# EAGLE design Motorsteuerung (EAGLE 6.0)
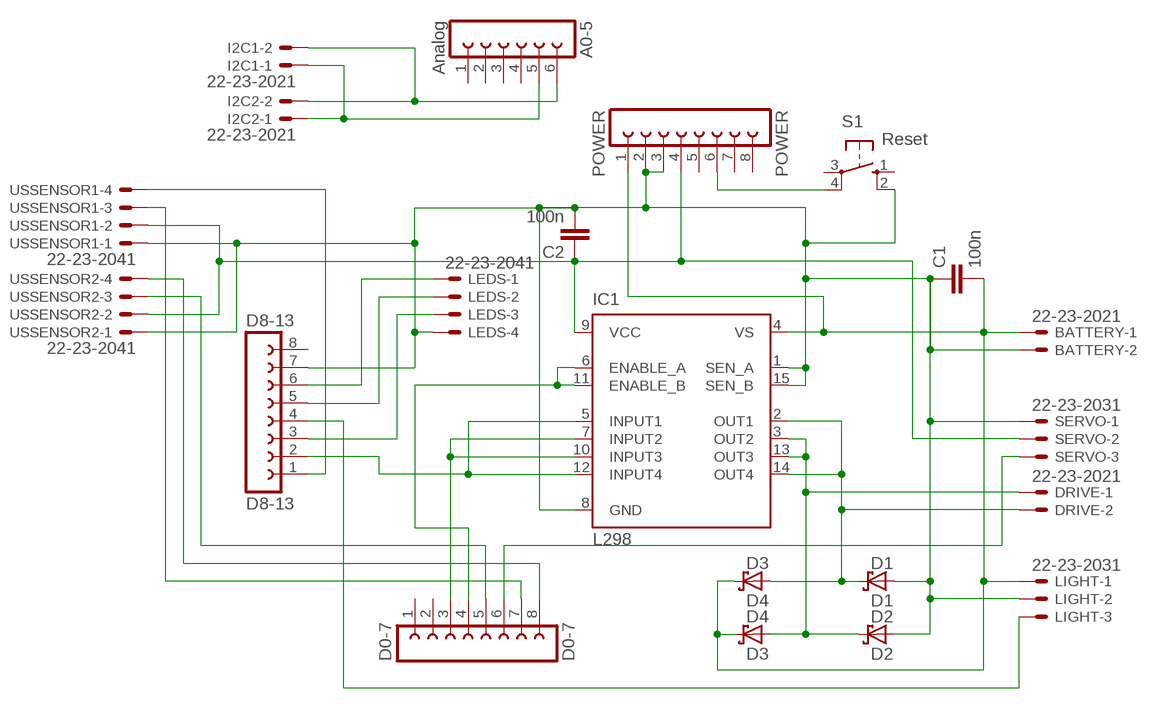
[diagram p0: schematic, sheet 1]

## Parts
A0-5  Analog  FE06-1  [FE06]
BATTERY  22-23-2021  [22-23-2021]
C1  100n  C-EU025-030X050  [C025-030X050]
C2  100n  C-EU025-030X050  [C025-030X050]
D0-7  D0-7  FE08-1  [FE08]
D1  D1  SCHOTTKY-DIODEDO201T15  [DO201T15]
D2  D2  SCHOTTKY-DIODEDO201T15  [DO201T15]
D3  D4  SCHOTTKY-DIODEDO201T15  [DO201T15]
D4  D3  SCHOTTKY-DIODEDO201T15  [DO201T15]
D8-13  D8-13  FE08-1  [FE08]
DRIVE  22-23-2021  [22-23-2021]
I2C1  22-23-2021  [22-23-2021]
I2C2  22-23-2021  [22-23-2021]
IC1  L298  [MULTIWATT-15]
LEDS  22-23-2041  [22-23-2041]
LIGHT  22-23-2031  [22-23-2031]
POWER  POWER  FE08-1  [FE08]
S1  Reset  10-XX  [B3F-10XX]
SERVO  22-23-2031  [22-23-2031]
USSENSOR1  22-23-2041  [22-23-2041]
USSENSOR2  22-23-2041  [22-23-2041]

## Nets
GND: BATTERY.2 C1.1 C2.2 D1.A D2.A D8-13.7 IC1.1(SEN_A) IC1.8(GND) IC1.15(SEN_B) LEDS.4 LIGHT.2 POWER.2 POWER.3 S1.2(S1) SERVO.1 USSENSOR1.1 USSENSOR2.1
N$1: D1.C D4.A DRIVE.2 IC1.2(OUT1) IC1.14(OUT4)
N$3: D0-7.6 SERVO.3
N$4: D0-7.8 USSENSOR2.4
N$5: D2.C D3.A DRIVE.1 IC1.3(OUT2) IC1.13(OUT3)
N$6: D8-13.5 LEDS.2
N$8: D8-13.2 IC1.5(INPUT1) IC1.12(INPUT4)
N$9: D0-7.5 USSENSOR2.3
N$10: D0-7.3 IC1.7(INPUT2) IC1.10(INPUT3)
N$11: D0-7.4 IC1.6(ENABLE_A) IC1.11(ENABLE_B)
N$12: D8-13.1 USSENSOR1.4
N$13: D8-13.3 LEDS.3
N$14: D8-13.4 LIGHT.3
N$16: D8-13.6 LEDS.1
N$17: D0-7.7 USSENSOR1.3
N$19: A0-5.5 I2C1.1 I2C2.1
N$20: POWER.6 S1.4(P1)
N$21: A0-5.6 I2C1.2 I2C2.2
VCC: C2.1 IC1.9(VCC) POWER.4 SERVO.2 USSENSOR1.2 USSENSOR2.2
VS: BATTERY.1 C1.2 D3.C D4.C IC1.4(VS) LIGHT.1 POWER.1
Unconnected: A0-5.1 A0-5.2 A0-5.3 A0-5.4 D0-7.1 D0-7.2 D8-13.8 POWER.5 POWER.7 POWER.8 S1.1(S) S1.3(P)

## Library data of the parts
A0-5 = con-lsta:FE06-1: FEMALE HEADER; OC_FARNELL: unknown; OC_NEWARK: unknown
BATTERY DRIVE I2C1 I2C2 = con-molex:22-23-2021: .100" (2.54mm) Center Header - 2 Pin; MF: MOLEX; MPN: 22-23-2021; OC_FARNELL: 1462926; OC_NEWARK: 25C3832
C1 C2 = rcl:C-EU: CAPACITOR, European symbol
D0-7 D8-13 POWER = con-lsta:FE08-1: FEMALE HEADER; OC_FARNELL: unknown; OC_NEWARK: unknown
D1-D4 = diode:SCHOTTKY-DIODE: Schottky Diode
IC1 = st-microelectronics:L298: DUAL FULL-BRIDGE DRIVER; MPN: L298N; OC_FARNELL: 1589425; OC_NEWARK: 32M1527
LEDS USSENSOR1 USSENSOR2 = con-molex:22-23-2041: .100" (2.54mm) Center Header - 4 Pin; MF: MOLEX; MPN: 22-23-2041; OC_FARNELL: 1462920; OC_NEWARK: 38C0355
LIGHT SERVO = con-molex:22-23-2031: .100" (2.54mm) Center Header - 3 Pin; MF: MOLEX; MPN: 22-23-2031; OC_FARNELL: 1462950; OC_NEWARK: 30C0862
S1 = switch-omron:10-XX: OMRON SWITCH; MPN: B3F-1000; OC_FARNELL: 176432; OC_NEWARK: 36M3542

## Board
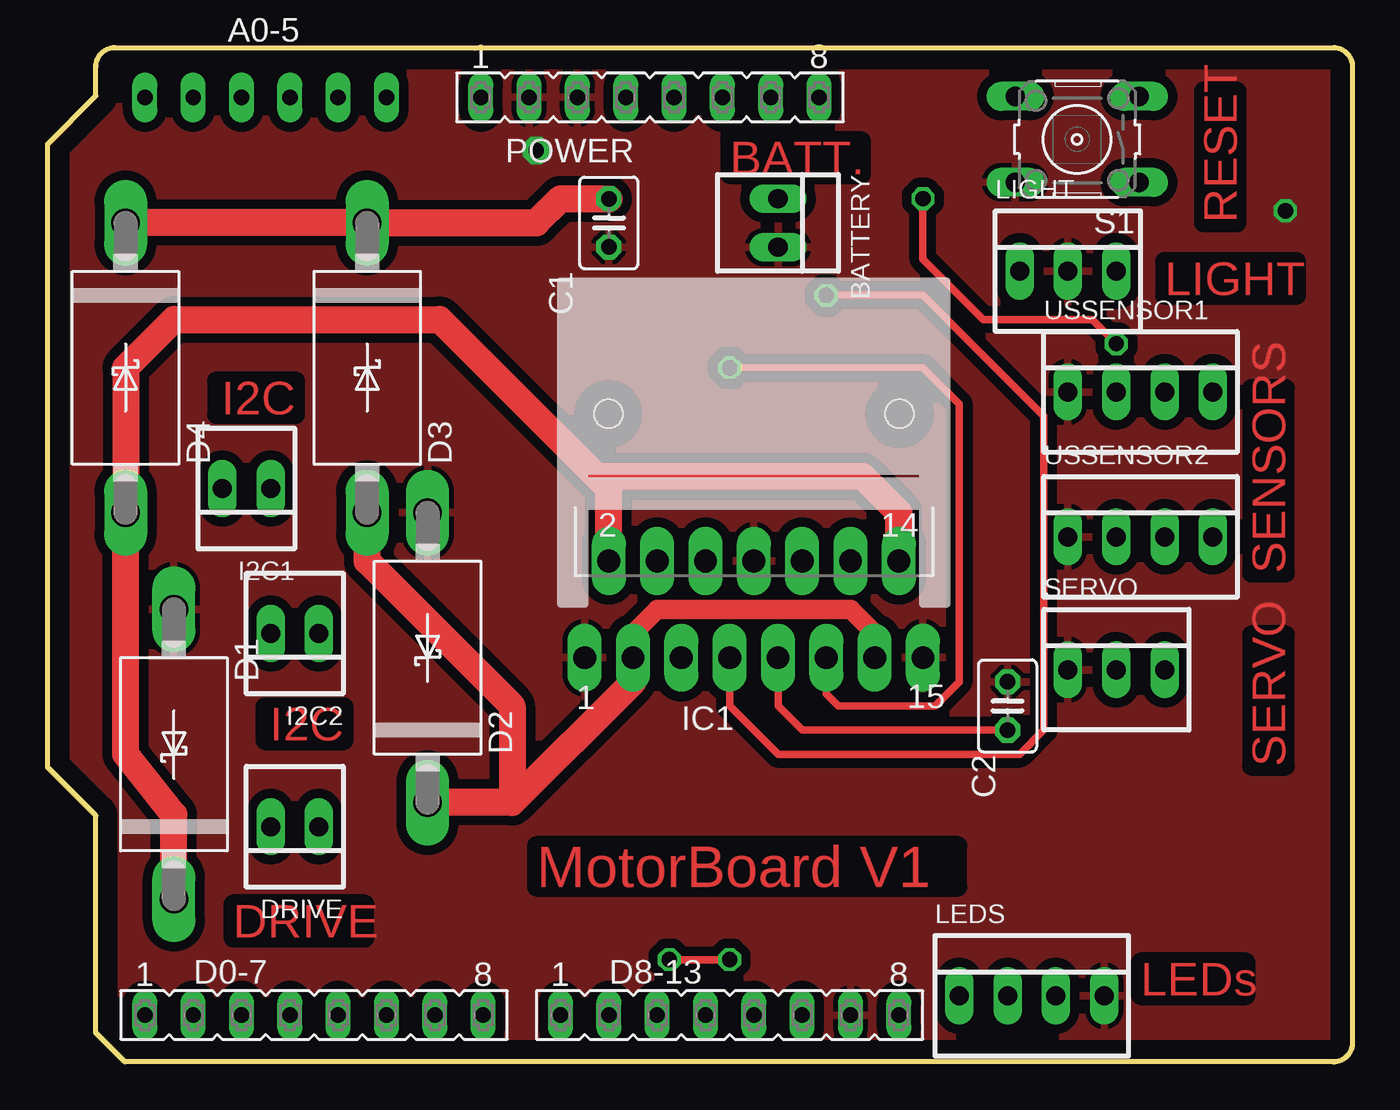
[diagram p1: board, top side]
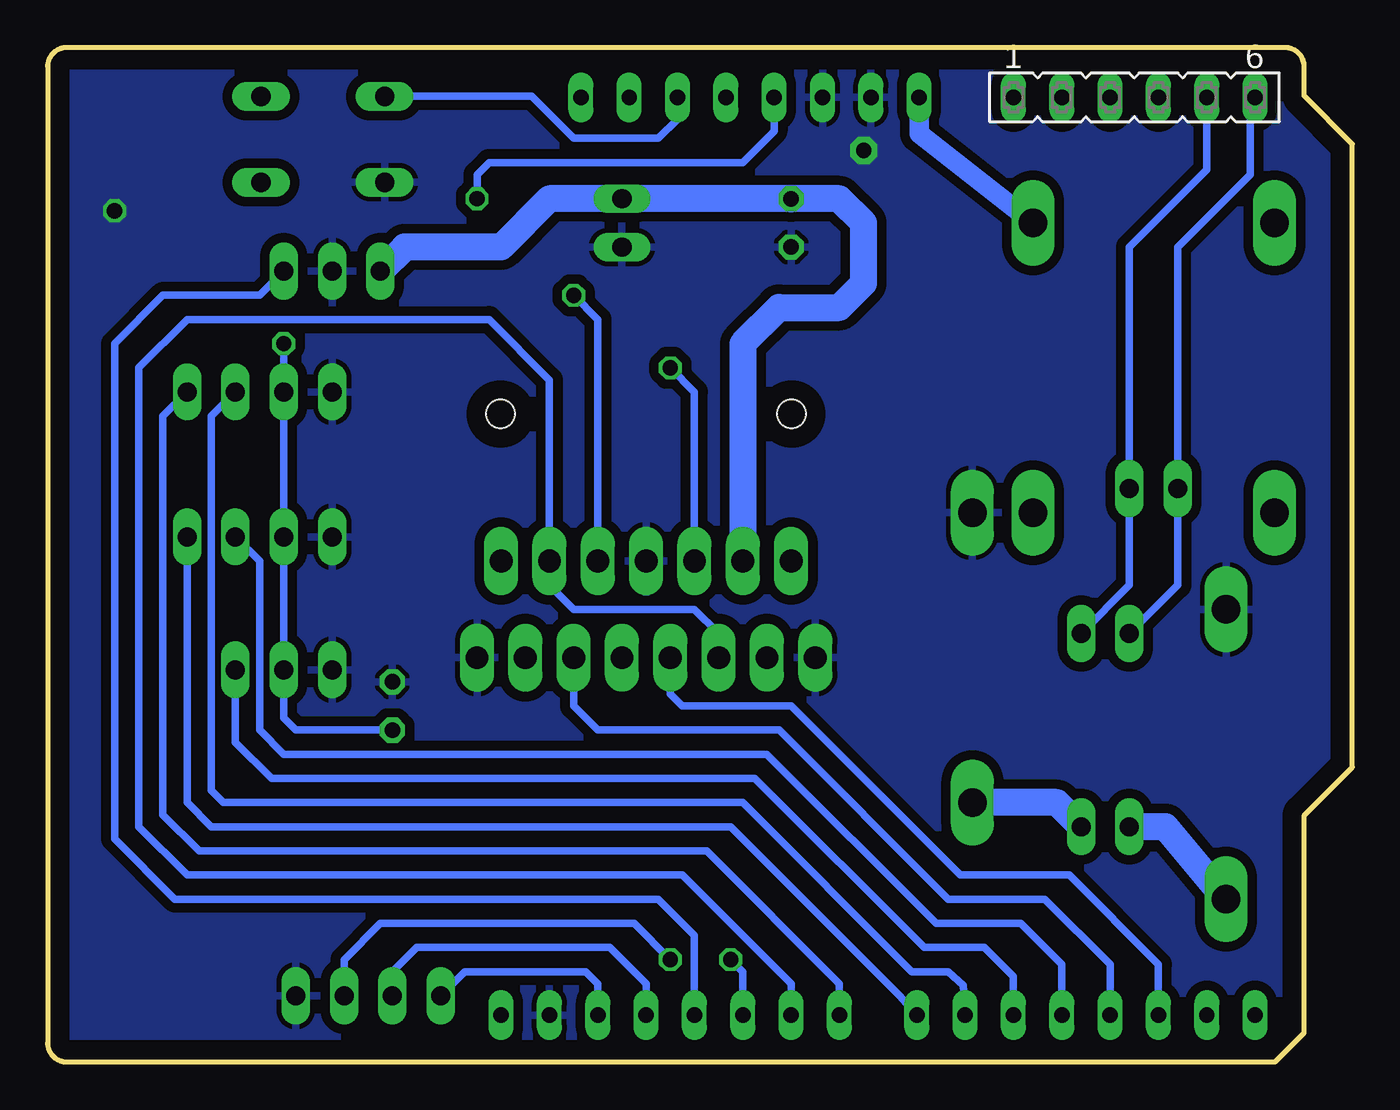
[diagram p2: board, bottom side, seen from below]

Size 68.58 x 53.34 mm. Coordinates in mm from the lower left corner, seen from the top.
Outline: 4.06,0 2.54,1.52 2.54,12.95 0,15.49 0,48.26 2.54,50.8 2.54,52.34 arc-90 3.54,53.34 67.58,53.34 arc-90 68.58,52.34 68.58,1 arc-90 67.58,0 4.06,0
Copper layers (1*16): Top 0.035mm / dielectric 1.5mm / Bottom 0.035mm
Design rules: minimum track width 10mil, minimum drill 24mil, track to track 8mil, track to pad 8mil, pad to pad 8mil, via to via 8mil, smd to smd 8mil, copper to edge 40mil, drill to drill 8mil, minimum pad ring 10mil, minimum via ring 8mil, stop-mask expansion 4mil, vias tented up to drill 0mil, thermal gap 10mil
Holes 1.5 mm at 29.47,34.07 44.77,34.07

### Footprints (pad centres in the part's own frame; a part is rotated, then mirrored left to right if it is on the bottom)
FE06 = drill 0.813 long: 1 -6.35,0; 2 -3.81,0; 3 -1.27,0; 4 1.27,0; 5 3.81,0; 6 6.35,0
22-23-2021 = drill 1 long: 1 -1.27,0; 2 1.27,0
C025-030X050 = drill 0.813 octagon: 1 -1.27,0; 2 1.27,0
FE08 = drill 0.813 long: 1 -8.89,0; 2 -6.35,0; 3 -3.81,0; 4 -1.27,0; 5 1.27,0; 6 3.81,0; 7 6.35,0; 8 8.89,0
DO201T15 = drill 1.499 long: A 7.62,0; C -7.62,0
MULTIWATT-15 = drill 1.2 long: 1 -8.89,-7.62; 2 -7.62,-2.54; 3 -6.35,-7.62; 4 -5.08,-2.54; 5 -3.81,-7.62; 6 -2.54,-2.54; 7 -1.27,-7.62; 8 0,-2.54; 9 1.27,-7.62; 10 2.54,-2.54; 11 3.81,-7.62; 12 5.08,-2.54; 13 6.35,-7.62; 14 7.62,-2.54; 15 8.89,-7.62
22-23-2041 = drill 1 long: 1 -3.81,0; 2 -1.27,0; 3 1.27,0; 4 3.81,0
22-23-2031 = drill 1 long: 1 -2.54,0; 2 0,0; 3 2.54,0
B3F-10XX = drill 1.016 long: 1 -3.251,2.261; 2 3.251,2.261; 3 -3.251,-2.261; 4 3.251,-2.261

### Placement (x,y rotation side)
A0-5  11.47,50.72 0 bottom
BATTERY  38.39,44.12 270 top
C1  29.5,44.12 90 top
C2  50.46,18.72 90 top
D0-7  14.01,2.46 0 top
D1  6.64,16.18 90 top
D2  19.97,21.26 90 top
D3  16.8,36.5 270 top
D4  4.1,36.5 270 top
D8-13  35.85,2.46 0 top
DRIVE  12.99,12.37 180 top
I2C1  10.45,30.15 180 top
I2C2  12.99,22.53 180 top
IC1  37.12,28.88 0 top
LEDS  51.73,3.48 0 top
LIGHT  53.63,41.58 0 top
POWER  31.66,50.72 0 top
S1  54.11,48.51 180 top
SERVO  56.17,20.62 0 top
USSENSOR1  57.44,35.23 0 top
USSENSOR2  57.44,27.61 0 top

### Tracks (layer width: path | path; a pad name or v marks a point on that pad's centre or on a via)
GND  (via drill 0.8, 0.8 pad 1.42)
  other vias: 65.06,44.76 25.69,47.93
  pour Top (isolate 0.5): 69.02,54.67 2.02,53.67 -0.98,48.67 -0.98,14.67 2.02,12.67 2.02,0.67 3.02,-0.33 69.02,-0.33
  pour Bottom (isolate 0.5): 1.56,54.28 1.56,51.74 -0.98,49.2 -0.98,14.91 1.56,12.37 1.56,0.94 2.83,-0.33 68.87,-0.33 68.87,54.28
N$1
  Top 1.422: 28.86,30.79 42.84,30.79 44.74,28.88 IC1.14 | D1.C 6.64,13.01 4.1,16.18 D4.A 4.1,36.5 6.64,39.04 20.61,39.04 28.86,30.79 | IC1.2 29.5,30.15 28.86,30.79
  Bottom 1.422: D1.C 9.81,12.37 DRIVE.2
N$3
  Bottom 0.406: D0-7.6 17.82,4.5 19.34,6.02 22.52,6.02 31.4,14.91 56.8,14.91 58.71,16.82 SERVO.3
N$4
  Bottom 0.406: USSENSOR2.4 61.25,13.64 59.98,12.37 32.68,12.37 23.79,3.48 D0-7.8
N$5
  Top 1.016: IC1.3 30.77,22.53 32.04,23.8 42.2,23.8 43.47,22.53 IC1.13
  Top 1.422: 24.42,13.64 30.77,19.99 IC1.3 | D3.A 16.8,26.34 24.42,18.72 24.42,13.64 | 24.42,13.64 D2.C
  Bottom 1.422: DRIVE.1 15.53,13.64 D2.C
N$6
  Bottom 0.406: D8-13.5 37.12,4.12 39.03,6.02 49.19,6.02 50.46,4.75 LEDS.2
N$8
  Bottom 0.406: IC1.5 33.31,22.53 34.58,23.8 40.93,23.8 42.2,25.07 IC1.12 42.2,35.87 45.38,39.04 61.25,39.04 63.79,36.5 63.79,12.37 61.25,9.83 35.22,9.83 29.5,4.12 D8-13.2
N$9
  Bottom 0.406: D0-7.5 15.28,5.13 17.43,7.29 21.88,7.29 30.77,16.18 56.17,16.18 57.44,17.45 57.44,26.34 USSENSOR2.3
N$10  (via drill 0.8)
  Top 0.406: IC1.7 35.85,18.72 38.39,16.18 51.09,16.18 52.36,17.45 52.36,33.96 46.01,40.31 v40.93,40.31
  Bottom 0.406: D0-7.3 10.2,5.13 14.89,9.83 20.61,9.83 29.5,18.72 35.22,18.72 35.85,19.36 IC1.7 | v40.93,40.31 39.66,39.04 IC1.10
N$11  (via drill 0.8)
  Top 0.406: v35.85,36.5 46.01,36.5 47.92,34.59 47.92,19.99 46.65,18.72 41.57,18.72 40.93,19.36 IC1.11
  Bottom 0.406: D0-7.4 12.74,5.13 16.16,8.56 21.25,8.56 30.13,17.45 39.66,17.45 40.93,18.72 IC1.11 | IC1.6 34.58,35.23 v35.85,36.5
N$12
  Bottom 0.406: USSENSOR1.4 62.52,33.96 62.52,13.01 60.62,11.1 33.95,11.1 26.96,4.12 D8-13.1
N$13  (via drill 0.8)
  Top 0.406: v32.68,5.38 v35.85,5.38
  Bottom 0.406: LEDS.3 53,5.38 51.09,7.29 37.76,7.29 v35.85,5.38 | D8-13.3 32.04,4.75 v32.68,5.38
N$14
  Bottom 0.406: LIGHT.3 57.44,40.31 62.52,40.31 65.06,37.77 65.06,11.73 61.89,8.56 36.49,8.56 34.58,6.66 D8-13.4
N$16
  Bottom 0.406: D8-13.6 39.66,4.12 40.3,4.75 46.65,4.75 LEDS.1
N$17
  Bottom 0.406: D0-7.7 20.36,2.59 20.45,4.02 21.25,4.75 23.15,4.75 32.04,13.64 59.35,13.64 59.98,14.28 59.98,33.96 USSENSOR1.3
N$19
  Bottom 0.406: A0-5.5 7.66,46.91 11.72,42.85 I2C1.1 11.72,25.07 I2C2.1
N$20
  Bottom 0.406: S1.4 43.14,50.77 40.93,48.57 36.49,48.57 35.47,49.58 POWER.6
N$21
  Bottom 0.406: I2C2.2 9.18,25.07 I2C1.2 9.18,42.85 5.37,46.66 5.37,50.47 A0-5.6
VCC  (via drill 0.8)
  Top 0.4: 38.39,18.72 39.66,17.45 | 49.82,17.45 C2.1
  Top 0.406: IC1.9 38.39,18.72 | 39.66,17.45 49.82,17.45 | v56.17,37.77 54.9,39.04 49.19,39.04 46.01,42.22 v46.01,45.39
  Bottom 0.406: POWER.4 30.39,48.95 32.04,47.3 45.38,47.3 46.01,46.66 v46.01,45.39 | v56.17,37.77 USSENSOR1.2 USSENSOR2.2 SERVO.2 56.17,18.09 55.54,17.45 C2.1
VS
  Top 1.422: D4.C D3.C 25.69,44.12 26.96,45.39 C1.2
  Bottom 1.016: POWER.1 22.77,48.82 D3.C
  Bottom 1.422: IC1.4 32.04,37.77 30.13,39.68 26.96,39.68 25.69,40.95 25.69,44.12 26.96,45.39 C1.2 BATTERY.1 42.2,45.39 44.74,42.85 49.82,42.85 LIGHT.1

### Text on the board
Top: BATT. | RESET | LIGHT | I2C | SENSORS | I2C | SERVO | MotorBoard V1 | DRIVE | LEDs
tRestrict: BATT. | RESET | LIGHT | I2C | SENSORS | I2C | SERVO | MotorBoard V1 | DRIVE | LEDs